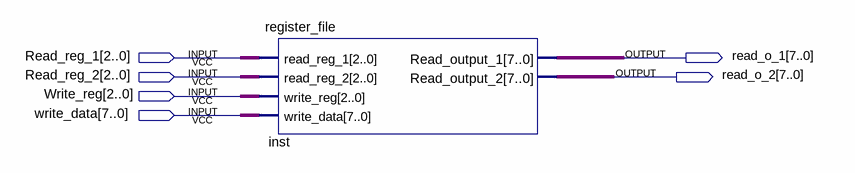
[diagram p0: schematic sheet]
// Quartus schematic testing_reg_file.bdf as structural Verilog: 1 symbols, 6 pins
module testing_reg_file (
  input  [2:0] Read_reg_1,
  input  [2:0] Read_reg_2,
  input  [2:0] Write_reg,
  input  [7:0] write_data,
  output [7:0] read_o_1,
  output [7:0] read_o_2
);

  register_file inst (
    .read_reg_1(Read_reg_1), .read_reg_2(Read_reg_2), .write_reg(Write_reg), .write_data(write_data),
    .Read_output_1(read_o_1), .Read_output_2(read_o_2));
endmodule
